# Altium schematic sheet MCU.SchDoc
size A3
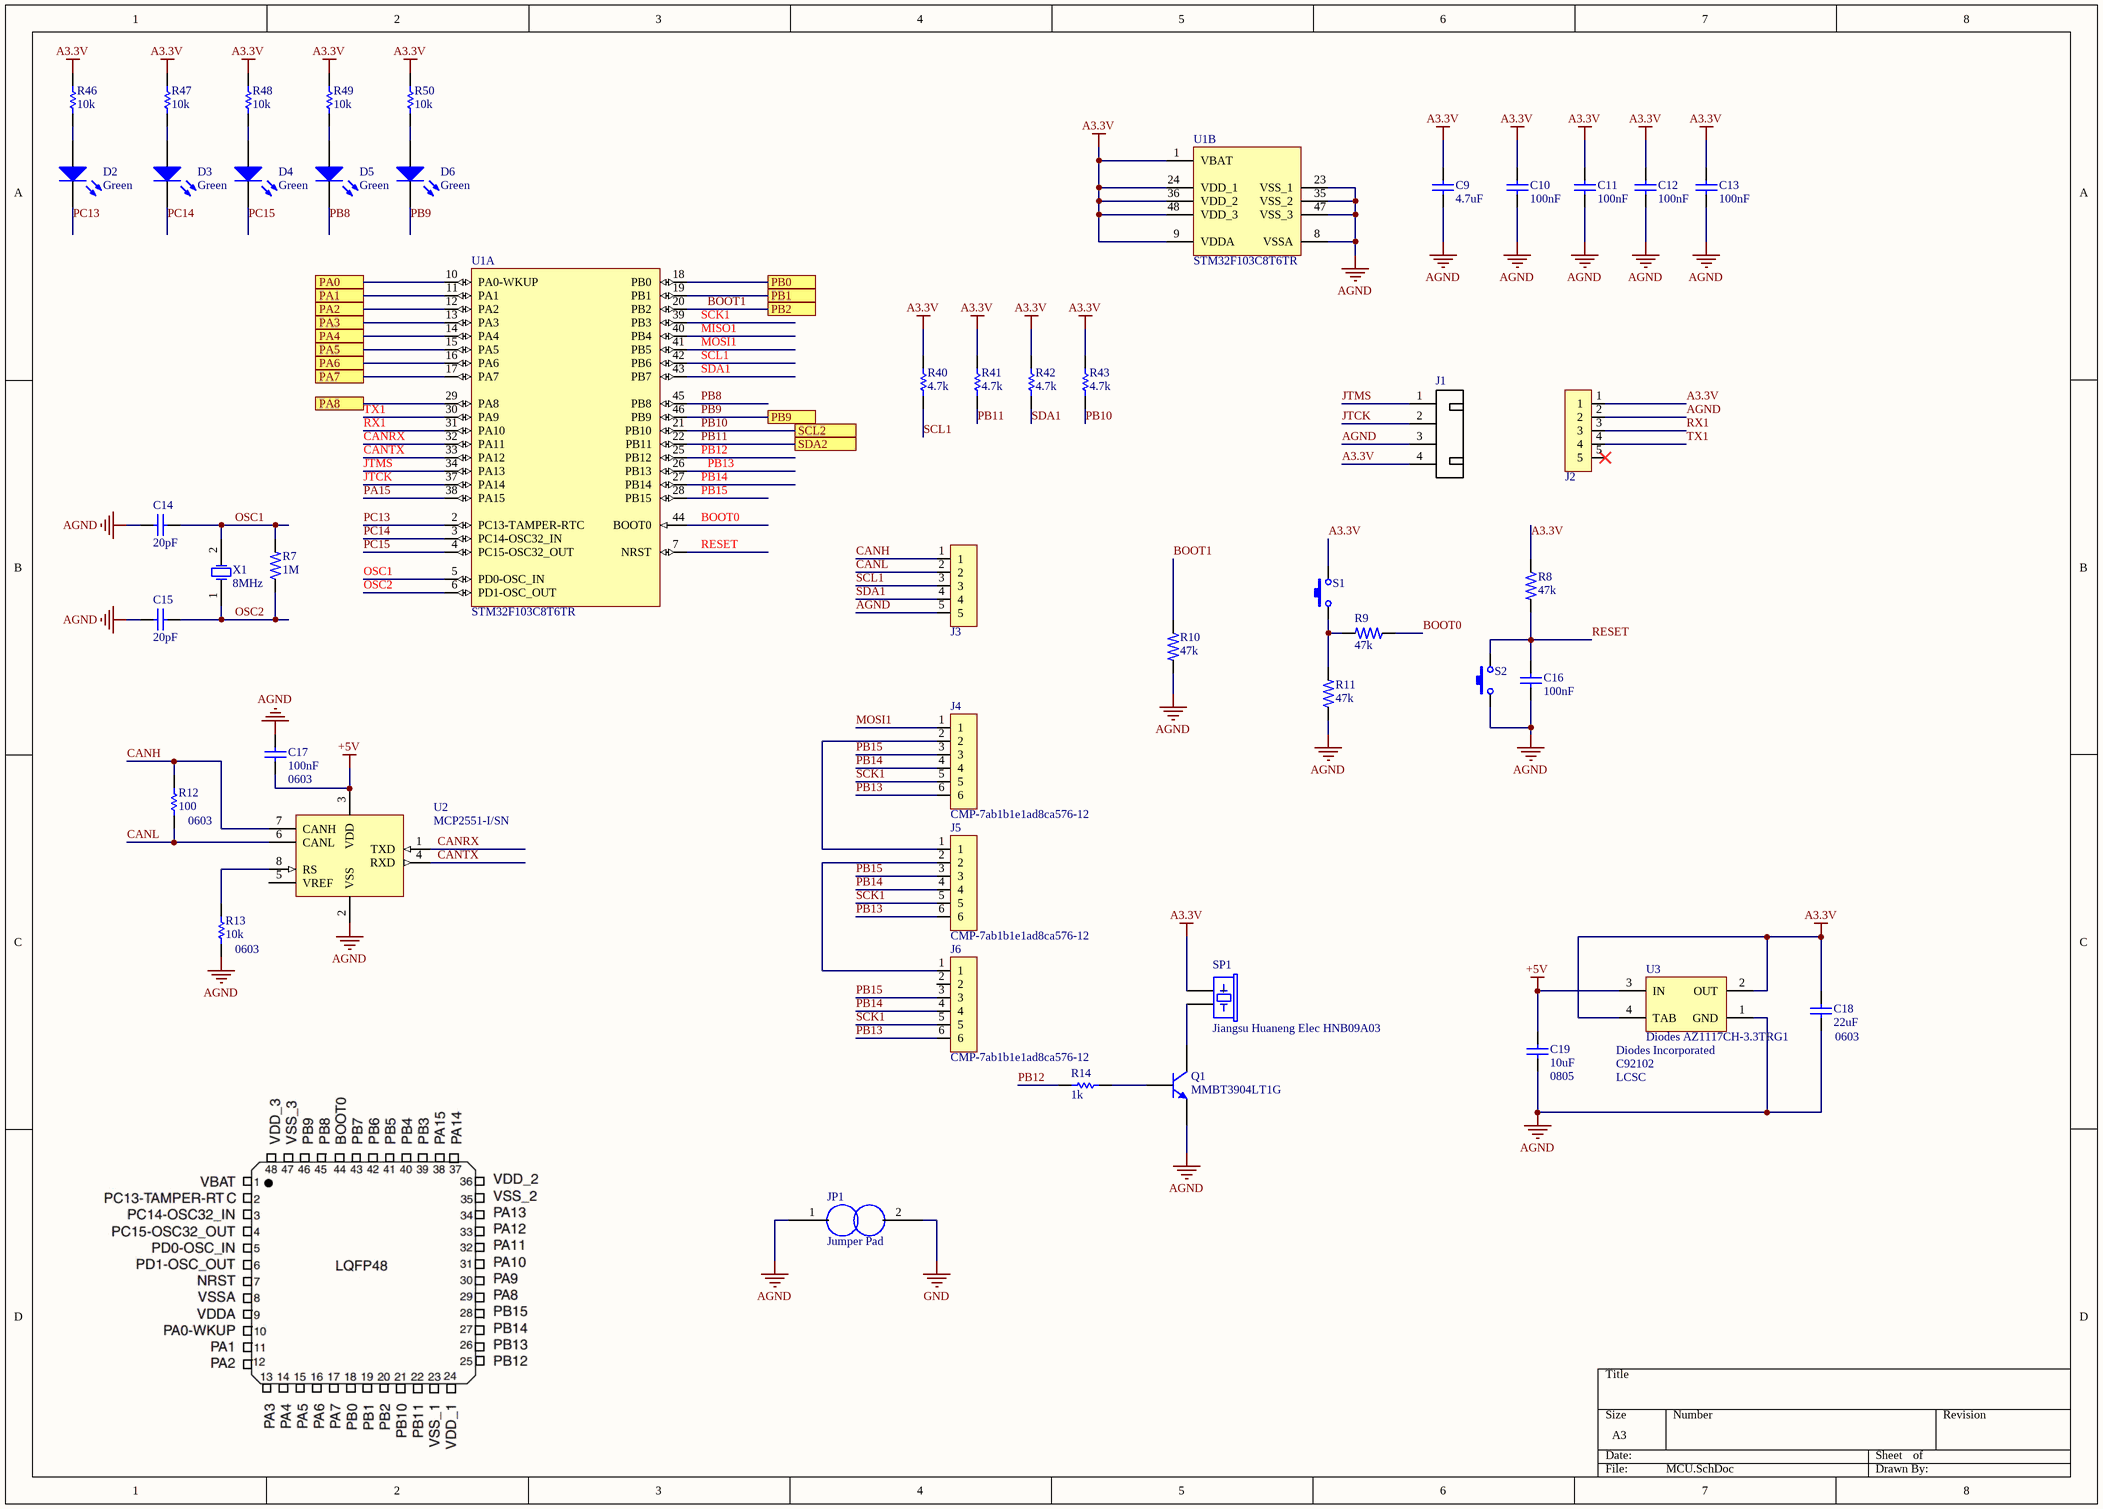
[diagram p0: MCU.SchDoc]

## Parts
C9  4.7uF  [CAPC1608X09N]
C10  100nF  [CAPC1608X09N]
C11  100nF  [CAPC1608X09N]
C12  100nF  [CAPC1608X09N]
C13  100nF  [CAPC1608X09N]
C14  20pF  [CAPC1608X09N]
C15  20pF  [CAPC1608X09N]
C16  100nF  [CAPC1608X09N]
C17  100nF  Package / Case: 0603  [CAPC1608X09N]
C18  22uF  Package / Case: 0603  [CAPC1608X09N]
C19  10uF  Package / Case: 0805  [C0805]
D2  Green  [PCBComponent_1 - duplicate]
D3  Green  [PCBComponent_1 - duplicate]
D4  Green  [PCBComponent_1 - duplicate]
D5  Green  [PCBComponent_1 - duplicate]
D6  Green  [PCBComponent_1 - duplicate]
J1  CMP-a6466f3bff057981-11  [PCB-z52whxwf67d3eu6gna8s-1]  (value not drawn)
J2  TE Connectivity / AMP 3-644456-5  [PCB-rnlen50cc5tt6vc22c1r-1]  (value not drawn)
J3  TE Connectivity / AMP 3-644456-5  [PCB-rnlen50cc5tt6vc22c1r-1]  (value not drawn)
J4  CMP-7ab1b1e1ad8ca576-12  [PCB-oudem42uhcimrbfznktg-1]
J5  CMP-7ab1b1e1ad8ca576-12  [PCB-oudem42uhcimrbfznktg-1]
J6  CMP-7ab1b1e1ad8ca576-12  [PCB-oudem42uhcimrbfznktg-1]
JP1  Jumper Pad  [PCB-sjva3kmaxrqfkswkvsp7-1]
Q1  MMBT3904LT1G  [SOT-23]
R7  1M  [PCB-3elf45qdqizoabmczrxc-1]
R8  47k  [PCB-3elf45qdqizoabmczrxc-1]
R9  47k  [PCB-3elf45qdqizoabmczrxc-1]
R10  47k  [PCB-3elf45qdqizoabmczrxc-1]
R11  47k  [PCB-3elf45qdqizoabmczrxc-1]
R12  100  Package / Case: 0603  [gen0603-2]
R13  10k  Package / Case: 0603  [gen0603-2]
R14  1k  [gen0603-2]
R40  4.7k  [gen0603-2]
R41  4.7k  [gen0603-2]
R42  4.7k  [gen0603-2]
R43  4.7k  [gen0603-2]
R46  10k  [gen0603-2]
R47  10k  [gen0603-2]
R48  10k  [gen0603-2]
R49  10k  [gen0603-2]
R50  10k  [gen0603-2]
S1  CMP-3c1bf499dccde3dc-3  [PCB-884bonwl6v4pb9lbnr4u-1]  (value not drawn)
S2  CMP-3c1bf499dccde3dc-3  [PCB-884bonwl6v4pb9lbnr4u-1]  (value not drawn)
SP1  Jiangsu Huaneng Elec HNB09A03  [PCB-gql0f0yk39bxcwo1gexj-1]
U1  STM32F103C8T6TR  [STM-LQFP48_M]  (parts A,B of 2)
U2  MCP2551-I/SN  [PCB-j27wim3vo61mdxz6aows-1]
U3  Diodes AZ1117CH-3.3TRG1  Manufacturer: Diodes Incorporated  Supplier Part Number: C92102  Supplier: LCSC  [PCB-15095235-1]
X1  8MHz  [XTAL1]

## Ports
PA0, PA1, PA2, PA3, PA4, PA5, PA6, PA7, PA8, PB0, PB1, PB2, PB9, SCL2, SDA2

## Nets
+5V: C17.2 C19.2 U2.3(VDD) U3.3(IN)
A3.3V: C9.2 C10.2 C11.2 C12.2 C13.2 C18.2 J1.4 J2.1 R8.1 R40.2 R41.2 R42.2 R43.2 R46.2 R47.2 R48.2 R49.2 R50.2 S1.2 SP1.1(+) U1.1(VBAT) U1.9(VDDA) U1.24(VDD_1) U1.36(VDD_2) U1.48(VDD_3) U3.2(OUT) U3.4(TAB)
AGND: C9.1 C10.1 C11.1 C12.1 C13.1 C14.2 C15.2 C16.1 C17.1 C18.1 C19.1 J1.3 J2.2 J3.5 JP1.1 Q1.2(E) R10.2 R11.1 R13.1 S2.1 U1.8(VSSA) U1.23(VSS_1) U1.35(VSS_2) U1.47(VSS_3) U2.2(VSS) U3.1(GND)
GND: JP1.2
BOOT0: R9.1 U1.44(BOOT0)
BOOT1: R10.1 U1.20(PB2) ; port PB2
CANH: J3.1 R12.2 U2.7(CANH)
CANL: J3.2 R12.1 U2.6(CANL)
CANRX: U1.32(PA11) U2.1(TXD)
CANTX: U1.33(PA12) U2.4(RXD)
JTCK: J1.2 U1.37(PA14)
JTMS: J1.1 U1.34(PA13)
MISO1: U1.40(PB4)
MOSI1: J4.1 U1.41(PB5)
OSC1: C14.1 R7.2 U1.5(PD0-OSC_IN) X1.2(X2)
OSC2: C15.1 R7.1 U1.6(PD1-OSC_OUT) X1.1(X1)
PA0: U1.10(PA0-WKUP) ; port PA0
PA1: U1.11(PA1) ; port PA1
PA2: U1.12(PA2) ; port PA2
PA3: U1.13(PA3) ; port PA3
PA4: U1.14(PA4) ; port PA4
PA5: U1.15(PA5) ; port PA5
PA6: U1.16(PA6) ; port PA6
PA7: U1.17(PA7) ; port PA7
PA8: U1.29(PA8) ; port PA8
PA15: U1.38(PA15)
PB0: U1.18(PB0) ; port PB0
PB1: U1.19(PB1) ; port PB1
PB8: D5.2(K) U1.45(PB8)
PB9: D6.2(K) U1.46(PB9) ; port PB9
PB10: R43.1 U1.21(PB10) ; port SCL2
PB11: R41.1 U1.22(PB11) ; port SDA2
PB12: R14.2 U1.25(PB12)
PB13: J4.6 J5.6 J6.6 U1.26(PB13)
PB14: J4.4 J5.4 J6.4 U1.27(PB14)
PB15: J4.3 J5.3 J6.3 U1.28(PB15)
PC13: D2.2(K) U1.2(PC13-TAMPER-RTC)
PC14: D3.2(K) U1.3(PC14-OSC32_IN)
PC15: D4.2(K) U1.4(PC15-OSC32_OUT)
RESET: C16.2 R8.2 S2.2 U1.7(NRST)
RX1: J2.3 U1.31(PA10)
SCK1: J4.5 J5.5 J6.5 U1.39(PB3)
SCL1: J3.3 R40.1 U1.42(PB6)
SDA1: J3.4 R42.1 U1.43(PB7)
TX1: J2.4 U1.30(PA9)
NetD2_1: D2.1(A) R46.1
NetD3_1: D3.1(A) R47.1
NetD4_1: D4.1(A) R48.1
NetD5_1: D5.1(A) R49.1
NetD6_1: D6.1(A) R50.1
NetJ4_2: J4.2 J5.1
NetJ5_2: J5.2 J6.1
NetQ1_1: Q1.1(B) R14.1
NetQ1_3: Q1.3(C) SP1.2(-)
NetR9_2: R9.2 R11.2 S1.1
NetR13_2: R13.2 U2.8(RS)

Not connected (* = marked no-connect by the designer): J2 5*; J6 2; U2 5(VREF)

## Library data of the parts
C9 = CMP-2f55e5122ad9f092-5: 0603 10 nF 50 V ± 10% Tolerance X7R Surface Mount Multilayer Ceramic Capacitor; Manufacture Part Number: CL10A475KP8NNNC; Manufacturer: Samsung Electro-Mechanics; Voltage-Rated: 10V; Capacitance: 4.7uF; Package / Case: 0603; Supplier: LCSC; Supplier Part Number: C1705; Capacitance Tolerance: 10%
C10-C13 C16 C17 = CMP-2f55e5122ad9f092-5: 0603 10 nF 50 V ± 10% Tolerance X7R Surface Mount Multilayer Ceramic Capacitor; Manufacture Part Number: CC0603KRX7R9BB104; Manufacturer: YAGEO; Voltage-Rated: 50V; Capacitance Tolerance: 10%; Capacitance: 100nF; Supplier: LCSC; Supplier Part Number: C14663
  C10-C13 C16: Package / Case: 0603
C14 C15 = CMP-2f55e5122ad9f092-5: 0603 10 nF 50 V ± 10% Tolerance X7R Surface Mount Multilayer Ceramic Capacitor; Manufacture Part Number: CC0603JRNPO9BN200; Manufacturer: YAGEO; Voltage-Rated: 50V; Capacitance Tolerance: 5%; Capacitance: 20pF; Package / Case: 0603; Supplier: LCSC; Supplier Part Number: C105621
C18 = CMP-2f55e5122ad9f092-5: 0603 10 nF 50 V ± 10% Tolerance X7R Surface Mount Multilayer Ceramic Capacitor; Manufacture Part Number: CL10A226MP8NUNE; Manufacturer: Samsung Electro-Mechanics; Capacitance Tolerance: 20%; Voltage-Rated: 10V; Capacitance: 22uF; Supplier: LCSC; Supplier Part Number: C86295
C19 = CMP-135114-3: Cap Ceramic 0.1uF 50V X7R 10% SMD 0805 125C Embossed T/R; Manufacture Part Number: CL21B106KOQNNNE; Manufacturer: Samsung Electro-Mechanics; Voltage-Rated: 16V; Capacitance Tolerance: *; Capacitance: 10uF; Supplier: LCSC; Supplier Part Number: C95841
D2-D6 = CMP-7ejgl1mi36gtz3spabtw-1: Generic LED 0603; Manufacturer: Orient; Manufacture Part Number: ORH-G36G; Forward Voltage: 2.8V; Color: Green; Supplier: LCSC; Supplier Part Number: C205443
J1 = CMP-a6466f3bff057981-11: XH Series 4 Position 2.5 mm Pitch Through Hole Crimp Top Entry Shrouded Header; Manufacture Part Number: B4B-XH-A (LF)(SN); Manufacturer: JST Sales America; Gender: Male; Voltage Rating (AC): 250 V; Current Rating: 3.00 A; Lead-Free Status: Lead Free; Contact Resistance: 10.0 mΩ; Company: JST; Insulation Resistance: 1.00 GΩ; Number of Contacts: 4; Contact Material: Brass; Contact Plating: Tin; Octopart URL: http://octopart.com/b4b-xh-a+%28lf%29%28sn%29-jst-7830565; Mounting Style: Through Hole, Vertical; RoHS: Compliant; OctopartID: a6466f3bff057981; REACH SVHC Compliance: No SVHC; Supplier Part Number: C144395; Supplier: LCSC
J2 J3 = CMP-b5d67e8662e76a11-19: MTA-100 5 Position Through-Hole Single Row Straight Wire to Board Header; Number of Positions: 5; Lead-Free Status: Lead Free; ELV Compliant: Compliant; Mounting Angle: 180 °; Shrouded: No; Gender: Male; Pin Pitch: 2.54 mm; Voltage Rating (AC): 250 V; Housing Color: Natural; Orientation: Vertical; Flammability Rating: UL 94 V-0; Lifecycle Status: Active; RoHS: Compliant; Contact Material: Copper Alloy; Mounting Style: Through Hole; Housing Material: Polyester; Packaging: Box, Bag; Contact Plating: Tin; Size-Length: 12.4 mm; Number of Rows: 1; OctopartID: b5d67e8662e76a11; Octopart URL: http://octopart.com/3-644456-5-te+connectivity+%2F+amp-39514711; Number of Contacts: 5; Size-Height: 2.54 mm; Size-Width: 2.34 mm
J4-J6 = CMP-7ab1b1e1ad8ca576-12: MTA-100 Series 6 Position 2.54 mm Pitch Single Row Tin Plated Header; Size-Height: 2.54 mm
JP1 = CMP-75tq5o8j4p0avfd6ylbk-1: JP; CustomComponentID: 75tq5o8j4p0avfd6ylbk
Q1 = CMP-857799-8: MMBT Series 40 V 200 mA SMT NPN Silicon General Purpose Transistor - SOT-23; Manufacturer: ON Semiconductor; Supplier Part Number: C81464; Supplier: LCSC; Manufacture Part Number: MMBT3904LT1G
R7 = CMP-1853278-23: Surface Mount Thick Film Resistor, RC Series, 1 kohm, 100 mW, - 1%, 50 V, 0603 [1608 Metric]; Manufacturer: UNI-ROYAL(Uniroyal Elec); Manufacture Part Number: 0603WAF1004T5E; Resistance Tolerance: 1%; Resistance: 1M; Supplier: LCSC; Supplier Part Number: C22935; Package / Case: 0603
R8-R11 = CMP-1853278-23: Surface Mount Thick Film Resistor, RC Series, 1 kohm, 100 mW, - 1%, 50 V, 0603 [1608 Metric]; Manufacturer: UNI-ROYAL(Uniroyal Elec); Manufacture Part Number: 0603WAF4702T5E; Resistance Tolerance: 1%; Resistance: 47k; Supplier: LCSC; Supplier Part Number: C25819; Package / Case: 0603
R12 = CMP-1853278-27: Surface Mount Thick Film Resistor, RC Series, 1 kohm, 100 mW, - 1%, 50 V, 0603 [1608 Metric]; Manufacturer: UNI-ROYAL(Uniroyal Elec); Manufacture Part Number: 0603WAF1000T5E; Resistance Tolerance: 1%; Supplier: LCSC; Supplier Part Number: C22775; Resistance: 100
R13 R46-R50 = CMP-1853278-27: Surface Mount Thick Film Resistor, RC Series, 1 kohm, 100 mW, - 1%, 50 V, 0603 [1608 Metric]; Manufacturer: YAGEO; Manufacture Part Number: RC0603FR-0710KL; Resistance Tolerance: 1%; Supplier: LCSC; Supplier Part Number: C98220; Resistance: 10k
  R46-R50: Package / Case: 0603
R14 = CMP-1853278-27_16: Surface Mount Thick Film Resistor, RC Series, 1 kohm, 100 mW, - 1%, 50 V, 0603 [1608 Metric]; Manufacturer: YAGEO; Manufacture Part Number: RC0603FR-071KL; Resistance Tolerance: 1%; Supplier: LCSC; Supplier Part Number: C22548; Resistance: 1k; Package / Case: 0603
R40-R43 = CMP-1853278-27: Surface Mount Thick Film Resistor, RC Series, 1 kohm, 100 mW, - 1%, 50 V, 0603 [1608 Metric]; Manufacture Part Number: RC0603FR-074K7L; Manufacturer: YAGEO; Package / Case: 0603; Resistance: 4.7k; Resistance Tolerance: 1%; Supplier: LCSC; Supplier Part Number: C99782
S1 S2 = CMP-3c1bf499dccde3dc-3: Switch Tactile N.O. SPST Rectangular Button Gull Wing 0.05A 12VDC 2.45N SMD; Manufacture Part Number: K2-1107ST-A4SW-06; Manufacturer: Korean Hroparts Elec; Lead-Free Status: Lead Free; RoHS: Compliant; Supplier Part Number: C118141; Supplier: LCSC
SP1 = CMP-8r7wb9d4hsrx0vdasxxy-1: Magnetic YES 3000±300Hz 90dB @ 3V, 10cm 3V ?9mm 9*5.5mm Buzzers RoHS; Manufacturer: Jiangsu Huaneng Elec; CustomComponentID: 8r7wb9d4hsrx0vdasxxy; Manufacture Part Number: HNB09A03; Supplier Part Number: C96102; Supplier: LCSC
U1 = CMP-2954476-4: ARM Cortex-M3 32-bit MCU, 64 KB Flash, 20 KB Internal RAM, 37 I/Os, 48-pin LQFP, -40 to 85 degC, Tape and Reel; Manufacturer: STMicroelectronics; Lead-Free Status: Lead Free; Lifecycle Status: Active; Octopart Url: https://octopart.com/stm32f103c8t6tr-stmicroelectronics-11955474; OctopartID: c3c10a7d8bb51c06; RoHS: Compliant; Manufacture Part Number: STM32F103C8T6; Supplier Part Number: C8734; Supplier: LCSC
U2 = MCP2551-I/SN: Microchip MCP2551-I/SN; CAN Transceiver1Mbit/s 1-channel ISO 11898; 8-Pin SOIC; Manufacturer: Microchip Tech; Supply Current: 75.0 mA; Supply Voltage (DC): 4.50 V (min), 5.50 V (max); Slew Rate: 8.50 V/μs; Data Rate: 1.00 Mbps; Lead-Free Status: Lead Free; Packaging: Tube; Octopart URL: https://octopart.com/mcp2551-i%2Fsn-microchip-99155; REACH SVHC Compliance: No SVHC; Number of Pins: 8; Octopart ID: 0bb6c2bdad83d471; OctopartID: 0bb6c2bdad83d471; Manufacture Part Number: MCP2551-I/SN; Supplier: LCSC; Supplier Part Number: C7376
U3 = CMP-15095235-4: IC REG LDO 3.3V 0.8A SOT223; Lead-Free Status: Lead Free; OctopartID: a6d46e06d6807913; Octopart Url: https://octopart.com/az1117ch-3.3trg1-diodes+inc.-30954802; Lifecycle Status: Not Listed by Manufacturer; RoHS: Compliant; Manufacture Part Number: AZ1117CH-3.3TRG1
X1 = CMP-4bca809c9193940d-1: Microprocessor, Crystal; 8 MHz; 30 ppm (Typ.) @ degC; 7 pF (Max.); 20 pF; Manufacturer: Yangxing Tech; Manufacture Part Number: X49SD8MSD2SC; Equivalent Series Resistance (ESR): 80.0 Ω; OctopartID: 4bca809c9193940d; Packaging: Bulk; Octopart Url: http://octopart.com/xt9s20ana8m-vishay+dale-39649087; Seller Landing  Url: https://octopart-clicks.com/click/track?country=US&ak=8157f166&sig=0e2aaf1&sid=2402&ppid=39649087&vpid=249355928&ct=offers; Mounting Style: Through Hole; Number of Pins: 2; Supplier: LCSC; Supplier Part Number: C21263